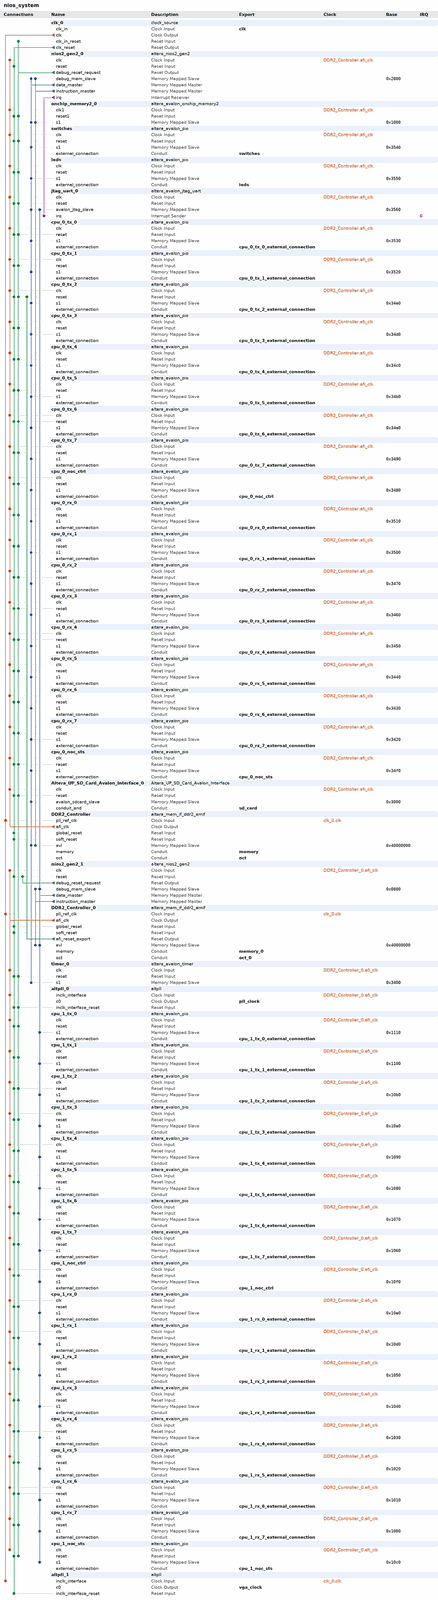
[diagram p0: system contents, whole]
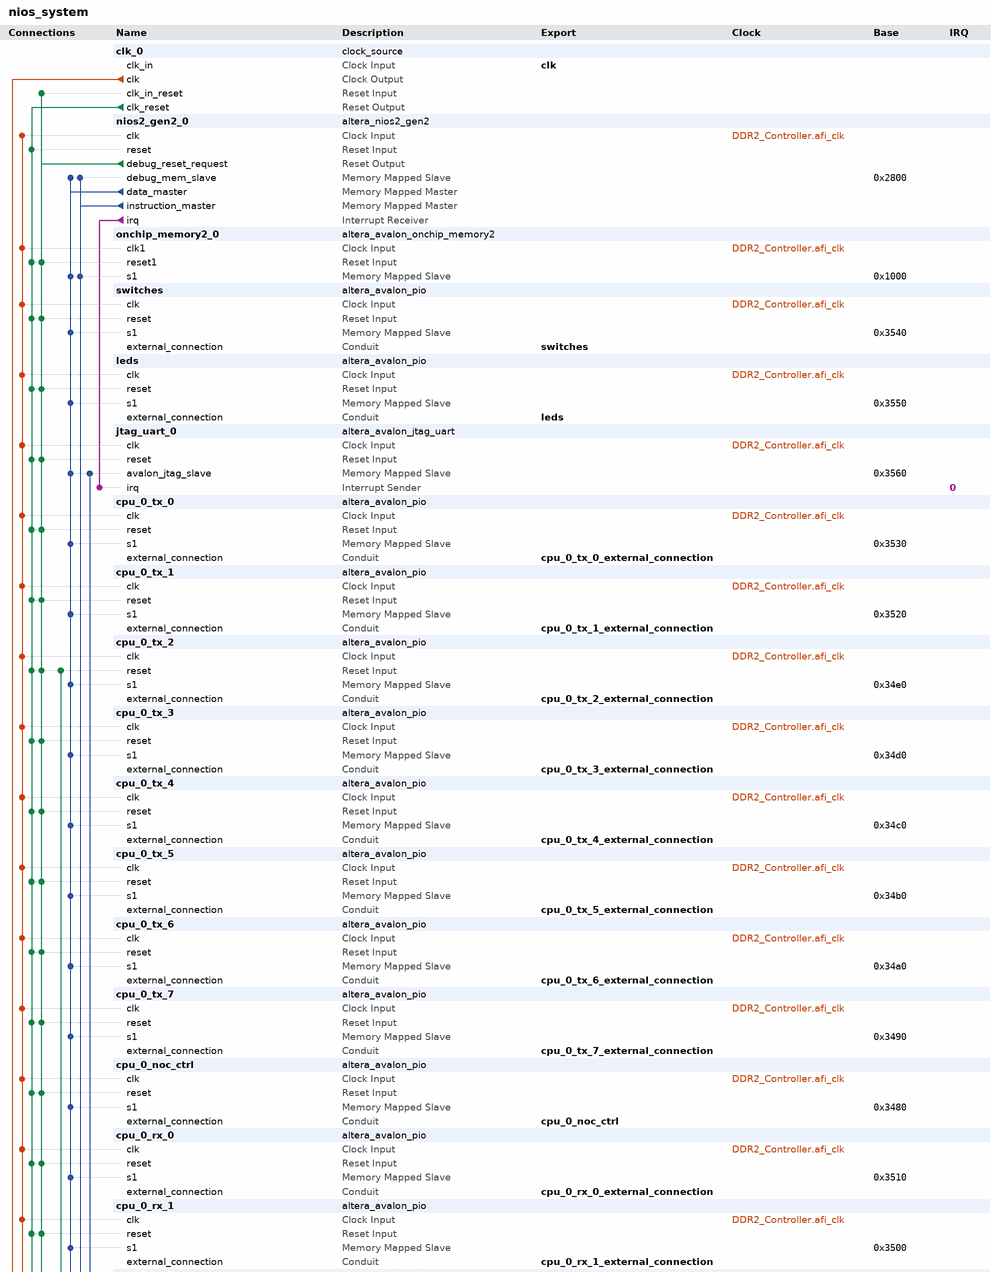
[diagram p1: system contents, upper part]
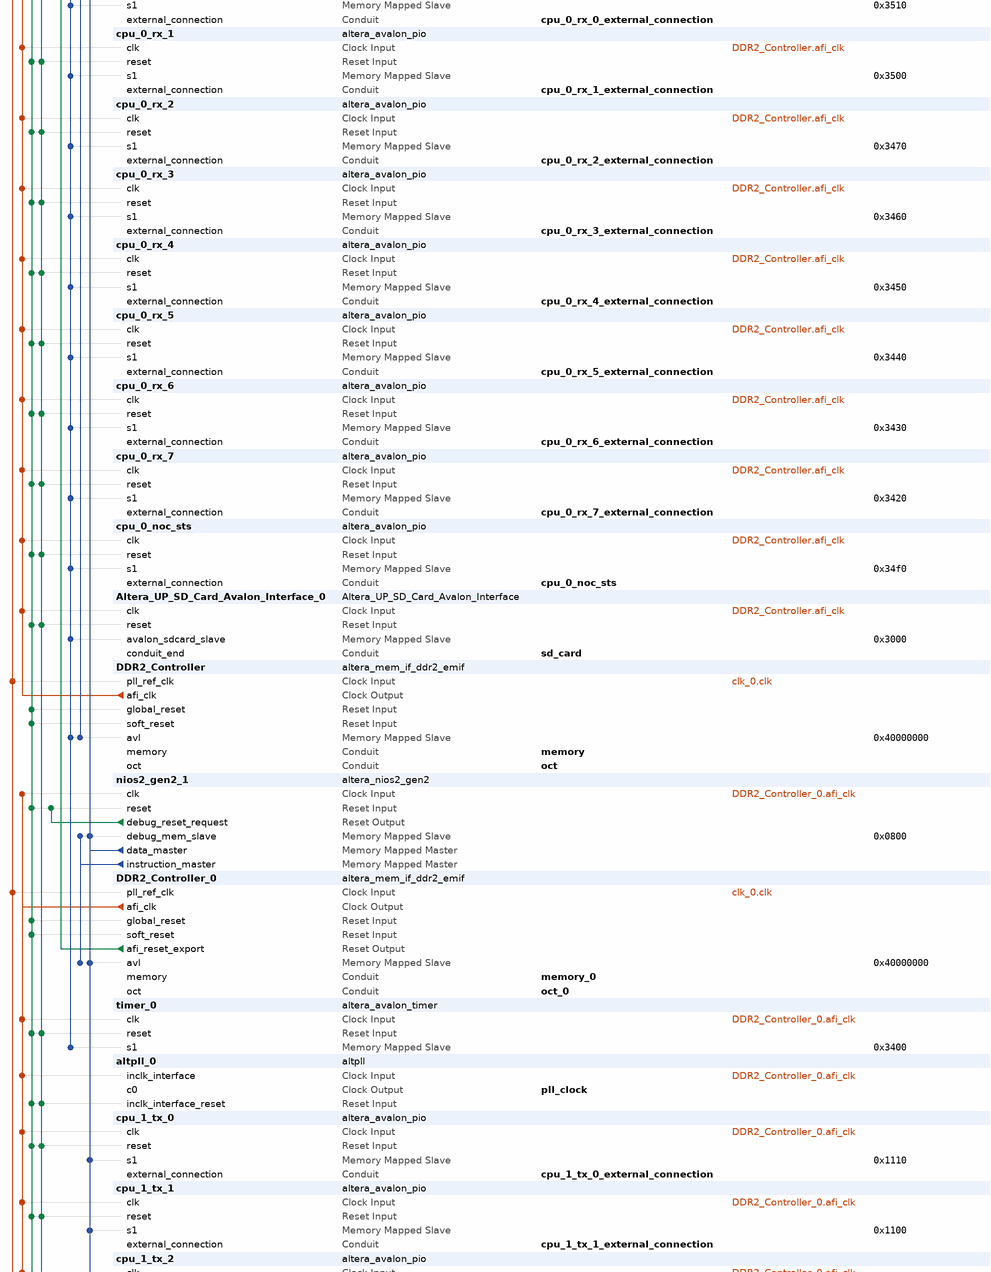
[diagram p2: system contents, middle part]
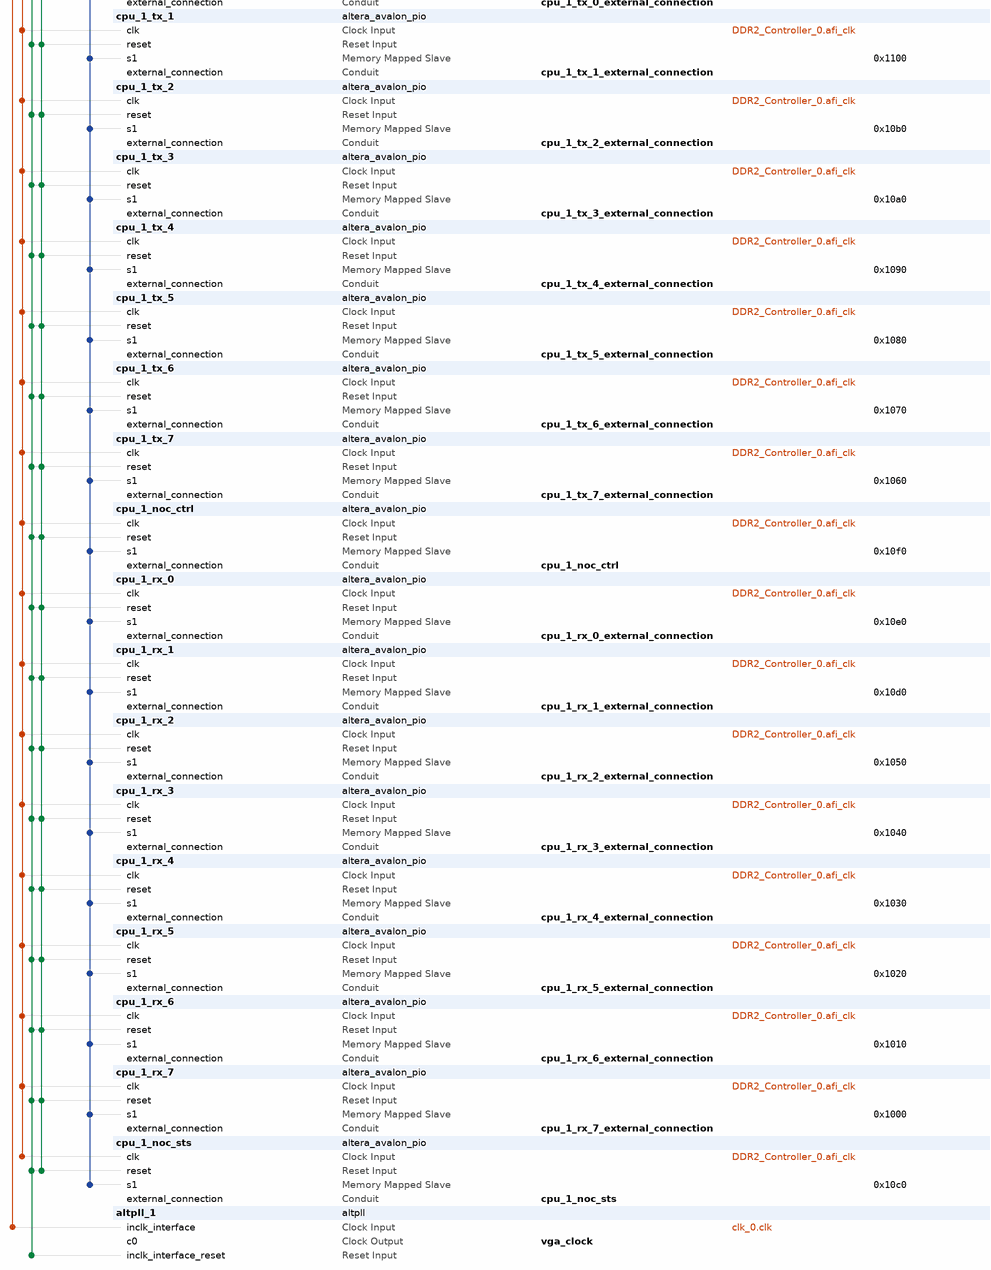
[diagram p3: system contents, lower part]
# Platform Designer (Qsys) system nios_system, Stratix IV EP4SGX230KF40C2
# Parameters at their usual value, and those the tool derives, are not listed.
package require -exact qsys 16.1
create_system nios_system
set_project_property DEVICE_FAMILY {Stratix IV}
set_project_property DEVICE EP4SGX230KF40C2

add_instance clk_0 clock_source 16.1
set_instance_parameter_value clk_0 clockFrequency 50000000

add_instance nios2_gen2_0 altera_nios2_gen2 16.1
set_instance_parameter_value nios2_gen2_0 dcache_size 2048
set_instance_parameter_value nios2_gen2_0 exceptionSlave DDR2_Controller.avl
set_instance_parameter_value nios2_gen2_0 icache_size 4096
set_instance_parameter_value nios2_gen2_0 impl Fast
set_instance_parameter_value nios2_gen2_0 resetSlave DDR2_Controller.avl
set_instance_parameter_value nios2_gen2_0 setting_support31bitdcachebypass false

add_instance onchip_memory2_0 altera_avalon_onchip_memory2 16.1
set_instance_parameter_value onchip_memory2_0 dataWidth 32
set_instance_parameter_value onchip_memory2_0 dualPort false
set_instance_parameter_value onchip_memory2_0 initMemContent true
set_instance_parameter_value onchip_memory2_0 initializationFileName onchip_mem.hex
set_instance_parameter_value onchip_memory2_0 memorySize 4096

add_instance switches altera_avalon_pio 16.1
set_instance_parameter_value switches direction Input
set_instance_parameter_value switches width 8

add_instance leds altera_avalon_pio 16.1
set_instance_parameter_value leds direction Output
set_instance_parameter_value leds width 8

add_instance jtag_uart_0 altera_avalon_jtag_uart 16.1
set_instance_parameter_value jtag_uart_0 simInteractiveOptions NO_INTERACTIVE_WINDOWS

add_instance cpu_0_tx_0 altera_avalon_pio 16.1
set_instance_parameter_value cpu_0_tx_0 direction Output
set_instance_parameter_value cpu_0_tx_0 width 32

add_instance cpu_0_tx_1 altera_avalon_pio 16.1
set_instance_parameter_value cpu_0_tx_1 direction Output
set_instance_parameter_value cpu_0_tx_1 width 32

add_instance cpu_0_tx_2 altera_avalon_pio 16.1
set_instance_parameter_value cpu_0_tx_2 direction Output
set_instance_parameter_value cpu_0_tx_2 width 32

add_instance cpu_0_tx_3 altera_avalon_pio 16.1
set_instance_parameter_value cpu_0_tx_3 direction Output
set_instance_parameter_value cpu_0_tx_3 width 32

add_instance cpu_0_tx_4 altera_avalon_pio 16.1
set_instance_parameter_value cpu_0_tx_4 direction Output
set_instance_parameter_value cpu_0_tx_4 width 32

add_instance cpu_0_tx_5 altera_avalon_pio 16.1
set_instance_parameter_value cpu_0_tx_5 direction Output
set_instance_parameter_value cpu_0_tx_5 width 32

add_instance cpu_0_tx_6 altera_avalon_pio 16.1
set_instance_parameter_value cpu_0_tx_6 direction Output
set_instance_parameter_value cpu_0_tx_6 width 32

add_instance cpu_0_tx_7 altera_avalon_pio 16.1
set_instance_parameter_value cpu_0_tx_7 direction Output
set_instance_parameter_value cpu_0_tx_7 width 32

add_instance cpu_0_noc_ctrl altera_avalon_pio 16.1
set_instance_parameter_value cpu_0_noc_ctrl direction Output
set_instance_parameter_value cpu_0_noc_ctrl width 32

add_instance cpu_0_rx_0 altera_avalon_pio 16.1
set_instance_parameter_value cpu_0_rx_0 direction Input
set_instance_parameter_value cpu_0_rx_0 width 32

add_instance cpu_0_rx_1 altera_avalon_pio 16.1
set_instance_parameter_value cpu_0_rx_1 direction Input
set_instance_parameter_value cpu_0_rx_1 width 32

add_instance cpu_0_rx_2 altera_avalon_pio 16.1
set_instance_parameter_value cpu_0_rx_2 direction Input
set_instance_parameter_value cpu_0_rx_2 width 32

add_instance cpu_0_rx_3 altera_avalon_pio 16.1
set_instance_parameter_value cpu_0_rx_3 direction Input
set_instance_parameter_value cpu_0_rx_3 width 32

add_instance cpu_0_rx_4 altera_avalon_pio 16.1
set_instance_parameter_value cpu_0_rx_4 direction Input
set_instance_parameter_value cpu_0_rx_4 width 32

add_instance cpu_0_rx_5 altera_avalon_pio 16.1
set_instance_parameter_value cpu_0_rx_5 direction Input
set_instance_parameter_value cpu_0_rx_5 width 32

add_instance cpu_0_rx_6 altera_avalon_pio 16.1
set_instance_parameter_value cpu_0_rx_6 direction Input
set_instance_parameter_value cpu_0_rx_6 width 32

add_instance cpu_0_rx_7 altera_avalon_pio 16.1
set_instance_parameter_value cpu_0_rx_7 direction Input
set_instance_parameter_value cpu_0_rx_7 width 32

add_instance cpu_0_noc_sts altera_avalon_pio 16.1
set_instance_parameter_value cpu_0_noc_sts direction Input
set_instance_parameter_value cpu_0_noc_sts width 32

add_instance Altera_UP_SD_Card_Avalon_Interface_0 Altera_UP_SD_Card_Avalon_Interface 16.0

add_instance DDR2_Controller altera_mem_if_ddr2_emif 16.1
set_instance_parameter_value DDR2_Controller AVL_MAX_SIZE 4
set_instance_parameter_value DDR2_Controller CALIBRATION_MODE Skip
set_instance_parameter_value DDR2_Controller DLL_SHARING_MODE None
set_instance_parameter_value DDR2_Controller EXPORT_AFI_HALF_CLK false
set_instance_parameter_value DDR2_Controller MEM_BANKADDR_WIDTH 3
set_instance_parameter_value DDR2_Controller MEM_CLK_FREQ 400.0
set_instance_parameter_value DDR2_Controller MEM_COL_ADDR_WIDTH 10
set_instance_parameter_value DDR2_Controller MEM_DQ_WIDTH 64
set_instance_parameter_value DDR2_Controller MEM_NUMBER_OF_RANKS_PER_DIMM 1
set_instance_parameter_value DDR2_Controller MEM_ROW_ADDR_WIDTH 14
set_instance_parameter_value DDR2_Controller MEM_TCL 6
set_instance_parameter_value DDR2_Controller MEM_TRAS_NS 40.0
set_instance_parameter_value DDR2_Controller MEM_VENDOR Hynix
set_instance_parameter_value DDR2_Controller PLL_SHARING_MODE None
set_instance_parameter_value DDR2_Controller POWER_OF_TWO_BUS false
set_instance_parameter_value DDR2_Controller REF_CLK_FREQ 50.0
set_instance_parameter_value DDR2_Controller TIMING_BOARD_AC_TO_CK_SKEW 0.0
set_instance_parameter_value DDR2_Controller TIMING_TDQSQ 200
set_instance_parameter_value DDR2_Controller TIMING_TIH 375
set_instance_parameter_value DDR2_Controller TIMING_TQHS 300
set_instance_parameter_value DDR2_Controller USER_DEBUG_LEVEL 1

add_instance nios2_gen2_1 altera_nios2_gen2 16.1
set_instance_parameter_value nios2_gen2_1 dcache_size 2048
set_instance_parameter_value nios2_gen2_1 exceptionSlave DDR2_Controller_0.avl
set_instance_parameter_value nios2_gen2_1 icache_size 4096
set_instance_parameter_value nios2_gen2_1 impl Fast
set_instance_parameter_value nios2_gen2_1 resetSlave DDR2_Controller_0.avl
set_instance_parameter_value nios2_gen2_1 setting_support31bitdcachebypass false

add_instance DDR2_Controller_0 altera_mem_if_ddr2_emif 16.1
set_instance_parameter_value DDR2_Controller_0 AVL_MAX_SIZE 4
set_instance_parameter_value DDR2_Controller_0 CALIBRATION_MODE Skip
set_instance_parameter_value DDR2_Controller_0 DLL_SHARING_MODE None
set_instance_parameter_value DDR2_Controller_0 EXPORT_AFI_HALF_CLK false
set_instance_parameter_value DDR2_Controller_0 MEM_BANKADDR_WIDTH 3
set_instance_parameter_value DDR2_Controller_0 MEM_CLK_FREQ 400.0
set_instance_parameter_value DDR2_Controller_0 MEM_COL_ADDR_WIDTH 10
set_instance_parameter_value DDR2_Controller_0 MEM_DQ_WIDTH 64
set_instance_parameter_value DDR2_Controller_0 MEM_NUMBER_OF_RANKS_PER_DIMM 1
set_instance_parameter_value DDR2_Controller_0 MEM_ROW_ADDR_WIDTH 14
set_instance_parameter_value DDR2_Controller_0 MEM_TCL 6
set_instance_parameter_value DDR2_Controller_0 MEM_TRAS_NS 40.0
set_instance_parameter_value DDR2_Controller_0 MEM_VENDOR Hynix
set_instance_parameter_value DDR2_Controller_0 PLL_SHARING_MODE None
set_instance_parameter_value DDR2_Controller_0 POWER_OF_TWO_BUS false
set_instance_parameter_value DDR2_Controller_0 REF_CLK_FREQ 50.0
set_instance_parameter_value DDR2_Controller_0 TIMING_BOARD_AC_TO_CK_SKEW 0.0
set_instance_parameter_value DDR2_Controller_0 TIMING_TDQSQ 200
set_instance_parameter_value DDR2_Controller_0 TIMING_TIH 375
set_instance_parameter_value DDR2_Controller_0 TIMING_TQHS 300
set_instance_parameter_value DDR2_Controller_0 USER_DEBUG_LEVEL 1

add_instance timer_0 altera_avalon_timer 16.1
set_instance_parameter_value timer_0 period 10
set_instance_parameter_value timer_0 periodUnits MSEC

add_instance altpll_0 altpll 16.1
set_instance_parameter_value altpll_0 CLK0_DIVIDE_BY 2
set_instance_parameter_value altpll_0 CLK0_MULTIPLY_BY 1
set_instance_parameter_value altpll_0 INCLK0_INPUT_FREQUENCY 2500
set_instance_parameter_value altpll_0 PORT_ARESET PORT_UNUSED
set_instance_parameter_value altpll_0 PORT_FBOUT PORT_UNUSED
set_instance_parameter_value altpll_0 PORT_LOCKED PORT_UNUSED
set_instance_parameter_value altpll_0 PORT_clk1 PORT_UNUSED
set_instance_parameter_value altpll_0 PORT_clk2 PORT_UNUSED
set_instance_parameter_value altpll_0 PORT_clk3 PORT_UNUSED
set_instance_parameter_value altpll_0 PORT_clk6 PORT_UNUSED
set_instance_parameter_value altpll_0 PORT_clk7 PORT_UNUSED
set_instance_parameter_value altpll_0 PORT_clk8 PORT_UNUSED
set_instance_parameter_value altpll_0 PORT_clk9 PORT_UNUSED
set_instance_parameter_value altpll_0 USING_FBMIMICBIDIR_PORT OFF
set_instance_parameter_value altpll_0 WIDTH_CLOCK 10

add_instance cpu_1_tx_0 altera_avalon_pio 16.1
set_instance_parameter_value cpu_1_tx_0 direction Output
set_instance_parameter_value cpu_1_tx_0 width 32

add_instance cpu_1_tx_1 altera_avalon_pio 16.1
set_instance_parameter_value cpu_1_tx_1 direction Output
set_instance_parameter_value cpu_1_tx_1 width 32

add_instance cpu_1_tx_2 altera_avalon_pio 16.1
set_instance_parameter_value cpu_1_tx_2 direction Output
set_instance_parameter_value cpu_1_tx_2 width 32

add_instance cpu_1_tx_3 altera_avalon_pio 16.1
set_instance_parameter_value cpu_1_tx_3 direction Output
set_instance_parameter_value cpu_1_tx_3 width 32

add_instance cpu_1_tx_4 altera_avalon_pio 16.1
set_instance_parameter_value cpu_1_tx_4 direction Output
set_instance_parameter_value cpu_1_tx_4 width 32

add_instance cpu_1_tx_5 altera_avalon_pio 16.1
set_instance_parameter_value cpu_1_tx_5 direction Output
set_instance_parameter_value cpu_1_tx_5 width 32

add_instance cpu_1_tx_6 altera_avalon_pio 16.1
set_instance_parameter_value cpu_1_tx_6 direction Output
set_instance_parameter_value cpu_1_tx_6 width 32

add_instance cpu_1_tx_7 altera_avalon_pio 16.1
set_instance_parameter_value cpu_1_tx_7 direction Output
set_instance_parameter_value cpu_1_tx_7 width 32

add_instance cpu_1_noc_ctrl altera_avalon_pio 16.1
set_instance_parameter_value cpu_1_noc_ctrl direction Output
set_instance_parameter_value cpu_1_noc_ctrl width 32

add_instance cpu_1_rx_0 altera_avalon_pio 16.1
set_instance_parameter_value cpu_1_rx_0 direction Input
set_instance_parameter_value cpu_1_rx_0 width 32

add_instance cpu_1_rx_1 altera_avalon_pio 16.1
set_instance_parameter_value cpu_1_rx_1 direction Input
set_instance_parameter_value cpu_1_rx_1 width 32

add_instance cpu_1_rx_2 altera_avalon_pio 16.1
set_instance_parameter_value cpu_1_rx_2 direction Input
set_instance_parameter_value cpu_1_rx_2 width 32

add_instance cpu_1_rx_3 altera_avalon_pio 16.1
set_instance_parameter_value cpu_1_rx_3 direction Input
set_instance_parameter_value cpu_1_rx_3 width 32

add_instance cpu_1_rx_4 altera_avalon_pio 16.1
set_instance_parameter_value cpu_1_rx_4 direction Input
set_instance_parameter_value cpu_1_rx_4 width 32

add_instance cpu_1_rx_5 altera_avalon_pio 16.1
set_instance_parameter_value cpu_1_rx_5 direction Input
set_instance_parameter_value cpu_1_rx_5 width 32

add_instance cpu_1_rx_6 altera_avalon_pio 16.1
set_instance_parameter_value cpu_1_rx_6 direction Input
set_instance_parameter_value cpu_1_rx_6 width 32

add_instance cpu_1_rx_7 altera_avalon_pio 16.1
set_instance_parameter_value cpu_1_rx_7 direction Input
set_instance_parameter_value cpu_1_rx_7 width 32

add_instance cpu_1_noc_sts altera_avalon_pio 16.1
set_instance_parameter_value cpu_1_noc_sts direction Input
set_instance_parameter_value cpu_1_noc_sts width 32

add_instance altpll_1 altpll 16.1
set_instance_parameter_value altpll_1 CLK0_DIVIDE_BY 50
set_instance_parameter_value altpll_1 CLK0_MULTIPLY_BY 27
set_instance_parameter_value altpll_1 INCLK0_INPUT_FREQUENCY 20000
set_instance_parameter_value altpll_1 PORT_ARESET PORT_UNUSED
set_instance_parameter_value altpll_1 PORT_FBOUT PORT_UNUSED
set_instance_parameter_value altpll_1 PORT_LOCKED PORT_UNUSED
set_instance_parameter_value altpll_1 PORT_clk1 PORT_UNUSED
set_instance_parameter_value altpll_1 PORT_clk2 PORT_UNUSED
set_instance_parameter_value altpll_1 PORT_clk3 PORT_UNUSED
set_instance_parameter_value altpll_1 PORT_clk6 PORT_UNUSED
set_instance_parameter_value altpll_1 PORT_clk7 PORT_UNUSED
set_instance_parameter_value altpll_1 PORT_clk8 PORT_UNUSED
set_instance_parameter_value altpll_1 PORT_clk9 PORT_UNUSED
set_instance_parameter_value altpll_1 USING_FBMIMICBIDIR_PORT OFF
set_instance_parameter_value altpll_1 WIDTH_CLOCK 10

# connections
add_connection clk_0.clk altpll_1.inclk_interface clock
add_connection clk_0.clk DDR2_Controller.pll_ref_clk clock
add_connection clk_0.clk DDR2_Controller_0.pll_ref_clk clock
add_connection DDR2_Controller.afi_clk Altera_UP_SD_Card_Avalon_Interface_0.clk clock
add_connection DDR2_Controller.afi_clk cpu_0_noc_ctrl.clk clock
add_connection DDR2_Controller.afi_clk cpu_0_noc_sts.clk clock
add_connection DDR2_Controller.afi_clk cpu_0_rx_0.clk clock
add_connection DDR2_Controller.afi_clk cpu_0_rx_1.clk clock
add_connection DDR2_Controller.afi_clk cpu_0_rx_2.clk clock
add_connection DDR2_Controller.afi_clk cpu_0_rx_3.clk clock
add_connection DDR2_Controller.afi_clk cpu_0_rx_4.clk clock
add_connection DDR2_Controller.afi_clk cpu_0_rx_5.clk clock
add_connection DDR2_Controller.afi_clk cpu_0_rx_6.clk clock
add_connection DDR2_Controller.afi_clk cpu_0_rx_7.clk clock
add_connection DDR2_Controller.afi_clk cpu_0_tx_0.clk clock
add_connection DDR2_Controller.afi_clk cpu_0_tx_1.clk clock
add_connection DDR2_Controller.afi_clk cpu_0_tx_2.clk clock
add_connection DDR2_Controller.afi_clk cpu_0_tx_3.clk clock
add_connection DDR2_Controller.afi_clk cpu_0_tx_4.clk clock
add_connection DDR2_Controller.afi_clk cpu_0_tx_5.clk clock
add_connection DDR2_Controller.afi_clk cpu_0_tx_6.clk clock
add_connection DDR2_Controller.afi_clk cpu_0_tx_7.clk clock
add_connection DDR2_Controller.afi_clk jtag_uart_0.clk clock
add_connection DDR2_Controller.afi_clk leds.clk clock
add_connection DDR2_Controller.afi_clk nios2_gen2_0.clk clock
add_connection DDR2_Controller.afi_clk onchip_memory2_0.clk1 clock
add_connection DDR2_Controller.afi_clk switches.clk clock
add_connection DDR2_Controller_0.afi_clk altpll_0.inclk_interface clock
add_connection DDR2_Controller_0.afi_clk cpu_1_noc_ctrl.clk clock
add_connection DDR2_Controller_0.afi_clk cpu_1_noc_sts.clk clock
add_connection DDR2_Controller_0.afi_clk cpu_1_rx_0.clk clock
add_connection DDR2_Controller_0.afi_clk cpu_1_rx_1.clk clock
add_connection DDR2_Controller_0.afi_clk cpu_1_rx_2.clk clock
add_connection DDR2_Controller_0.afi_clk cpu_1_rx_3.clk clock
add_connection DDR2_Controller_0.afi_clk cpu_1_rx_4.clk clock
add_connection DDR2_Controller_0.afi_clk cpu_1_rx_5.clk clock
add_connection DDR2_Controller_0.afi_clk cpu_1_rx_6.clk clock
add_connection DDR2_Controller_0.afi_clk cpu_1_rx_7.clk clock
add_connection DDR2_Controller_0.afi_clk cpu_1_tx_0.clk clock
add_connection DDR2_Controller_0.afi_clk cpu_1_tx_1.clk clock
add_connection DDR2_Controller_0.afi_clk cpu_1_tx_2.clk clock
add_connection DDR2_Controller_0.afi_clk cpu_1_tx_3.clk clock
add_connection DDR2_Controller_0.afi_clk cpu_1_tx_4.clk clock
add_connection DDR2_Controller_0.afi_clk cpu_1_tx_5.clk clock
add_connection DDR2_Controller_0.afi_clk cpu_1_tx_6.clk clock
add_connection DDR2_Controller_0.afi_clk cpu_1_tx_7.clk clock
add_connection DDR2_Controller_0.afi_clk nios2_gen2_1.clk clock
add_connection DDR2_Controller_0.afi_clk timer_0.clk clock
add_connection clk_0.clk_reset Altera_UP_SD_Card_Avalon_Interface_0.reset reset
add_connection clk_0.clk_reset altpll_0.inclk_interface_reset reset
add_connection clk_0.clk_reset altpll_1.inclk_interface_reset reset
add_connection clk_0.clk_reset cpu_0_noc_ctrl.reset reset
add_connection clk_0.clk_reset cpu_0_noc_sts.reset reset
add_connection clk_0.clk_reset cpu_0_rx_0.reset reset
add_connection clk_0.clk_reset cpu_0_rx_1.reset reset
add_connection clk_0.clk_reset cpu_0_rx_2.reset reset
add_connection clk_0.clk_reset cpu_0_rx_3.reset reset
add_connection clk_0.clk_reset cpu_0_rx_4.reset reset
add_connection clk_0.clk_reset cpu_0_rx_5.reset reset
add_connection clk_0.clk_reset cpu_0_rx_6.reset reset
add_connection clk_0.clk_reset cpu_0_rx_7.reset reset
add_connection clk_0.clk_reset cpu_0_tx_0.reset reset
add_connection clk_0.clk_reset cpu_0_tx_1.reset reset
add_connection clk_0.clk_reset cpu_0_tx_2.reset reset
add_connection clk_0.clk_reset cpu_0_tx_3.reset reset
add_connection clk_0.clk_reset cpu_0_tx_4.reset reset
add_connection clk_0.clk_reset cpu_0_tx_5.reset reset
add_connection clk_0.clk_reset cpu_0_tx_6.reset reset
add_connection clk_0.clk_reset cpu_0_tx_7.reset reset
add_connection clk_0.clk_reset cpu_1_noc_ctrl.reset reset
add_connection clk_0.clk_reset cpu_1_noc_sts.reset reset
add_connection clk_0.clk_reset cpu_1_rx_0.reset reset
add_connection clk_0.clk_reset cpu_1_rx_1.reset reset
add_connection clk_0.clk_reset cpu_1_rx_2.reset reset
add_connection clk_0.clk_reset cpu_1_rx_3.reset reset
add_connection clk_0.clk_reset cpu_1_rx_4.reset reset
add_connection clk_0.clk_reset cpu_1_rx_5.reset reset
add_connection clk_0.clk_reset cpu_1_rx_6.reset reset
add_connection clk_0.clk_reset cpu_1_rx_7.reset reset
add_connection clk_0.clk_reset cpu_1_tx_0.reset reset
add_connection clk_0.clk_reset cpu_1_tx_1.reset reset
add_connection clk_0.clk_reset cpu_1_tx_2.reset reset
add_connection clk_0.clk_reset cpu_1_tx_3.reset reset
add_connection clk_0.clk_reset cpu_1_tx_4.reset reset
add_connection clk_0.clk_reset cpu_1_tx_5.reset reset
add_connection clk_0.clk_reset cpu_1_tx_6.reset reset
add_connection clk_0.clk_reset cpu_1_tx_7.reset reset
add_connection clk_0.clk_reset DDR2_Controller.global_reset reset
add_connection clk_0.clk_reset DDR2_Controller.soft_reset reset
add_connection clk_0.clk_reset DDR2_Controller_0.global_reset reset
add_connection clk_0.clk_reset DDR2_Controller_0.soft_reset reset
add_connection clk_0.clk_reset jtag_uart_0.reset reset
add_connection clk_0.clk_reset leds.reset reset
add_connection clk_0.clk_reset nios2_gen2_0.reset reset
add_connection clk_0.clk_reset nios2_gen2_1.reset reset
add_connection clk_0.clk_reset onchip_memory2_0.reset1 reset
add_connection clk_0.clk_reset switches.reset reset
add_connection clk_0.clk_reset timer_0.reset reset
add_connection DDR2_Controller_0.afi_reset_export cpu_0_tx_2.reset reset
add_connection nios2_gen2_0.debug_reset_request Altera_UP_SD_Card_Avalon_Interface_0.reset reset
add_connection nios2_gen2_0.debug_reset_request altpll_0.inclk_interface_reset reset
add_connection nios2_gen2_0.debug_reset_request clk_0.clk_in_reset reset
add_connection nios2_gen2_0.debug_reset_request cpu_0_noc_ctrl.reset reset
add_connection nios2_gen2_0.debug_reset_request cpu_0_noc_sts.reset reset
add_connection nios2_gen2_0.debug_reset_request cpu_0_rx_0.reset reset
add_connection nios2_gen2_0.debug_reset_request cpu_0_rx_1.reset reset
add_connection nios2_gen2_0.debug_reset_request cpu_0_rx_2.reset reset
add_connection nios2_gen2_0.debug_reset_request cpu_0_rx_3.reset reset
add_connection nios2_gen2_0.debug_reset_request cpu_0_rx_4.reset reset
add_connection nios2_gen2_0.debug_reset_request cpu_0_rx_5.reset reset
add_connection nios2_gen2_0.debug_reset_request cpu_0_rx_6.reset reset
add_connection nios2_gen2_0.debug_reset_request cpu_0_rx_7.reset reset
add_connection nios2_gen2_0.debug_reset_request cpu_0_tx_0.reset reset
add_connection nios2_gen2_0.debug_reset_request cpu_0_tx_1.reset reset
add_connection nios2_gen2_0.debug_reset_request cpu_0_tx_2.reset reset
add_connection nios2_gen2_0.debug_reset_request cpu_0_tx_3.reset reset
add_connection nios2_gen2_0.debug_reset_request cpu_0_tx_4.reset reset
add_connection nios2_gen2_0.debug_reset_request cpu_0_tx_5.reset reset
add_connection nios2_gen2_0.debug_reset_request cpu_0_tx_6.reset reset
add_connection nios2_gen2_0.debug_reset_request cpu_0_tx_7.reset reset
add_connection nios2_gen2_0.debug_reset_request cpu_1_noc_ctrl.reset reset
add_connection nios2_gen2_0.debug_reset_request cpu_1_noc_sts.reset reset
add_connection nios2_gen2_0.debug_reset_request cpu_1_rx_0.reset reset
add_connection nios2_gen2_0.debug_reset_request cpu_1_rx_1.reset reset
add_connection nios2_gen2_0.debug_reset_request cpu_1_rx_2.reset reset
add_connection nios2_gen2_0.debug_reset_request cpu_1_rx_3.reset reset
add_connection nios2_gen2_0.debug_reset_request cpu_1_rx_4.reset reset
add_connection nios2_gen2_0.debug_reset_request cpu_1_rx_5.reset reset
add_connection nios2_gen2_0.debug_reset_request cpu_1_rx_6.reset reset
add_connection nios2_gen2_0.debug_reset_request cpu_1_rx_7.reset reset
add_connection nios2_gen2_0.debug_reset_request cpu_1_tx_0.reset reset
add_connection nios2_gen2_0.debug_reset_request cpu_1_tx_1.reset reset
add_connection nios2_gen2_0.debug_reset_request cpu_1_tx_2.reset reset
add_connection nios2_gen2_0.debug_reset_request cpu_1_tx_3.reset reset
add_connection nios2_gen2_0.debug_reset_request cpu_1_tx_4.reset reset
add_connection nios2_gen2_0.debug_reset_request cpu_1_tx_5.reset reset
add_connection nios2_gen2_0.debug_reset_request cpu_1_tx_6.reset reset
add_connection nios2_gen2_0.debug_reset_request cpu_1_tx_7.reset reset
add_connection nios2_gen2_0.debug_reset_request jtag_uart_0.reset reset
add_connection nios2_gen2_0.debug_reset_request leds.reset reset
add_connection nios2_gen2_0.debug_reset_request onchip_memory2_0.reset1 reset
add_connection nios2_gen2_0.debug_reset_request switches.reset reset
add_connection nios2_gen2_0.debug_reset_request timer_0.reset reset
add_connection nios2_gen2_1.debug_reset_request nios2_gen2_1.reset reset
add_connection nios2_gen2_0.data_master Altera_UP_SD_Card_Avalon_Interface_0.avalon_sdcard_slave avalon
set_connection_parameter_value nios2_gen2_0.data_master/Altera_UP_SD_Card_Avalon_Interface_0.avalon_sdcard_slave baseAddress 0x3000
add_connection nios2_gen2_0.data_master cpu_0_noc_ctrl.s1 avalon
set_connection_parameter_value nios2_gen2_0.data_master/cpu_0_noc_ctrl.s1 baseAddress 0x3480
add_connection nios2_gen2_0.data_master cpu_0_noc_sts.s1 avalon
set_connection_parameter_value nios2_gen2_0.data_master/cpu_0_noc_sts.s1 baseAddress 0x34f0
add_connection nios2_gen2_0.data_master cpu_0_rx_0.s1 avalon
set_connection_parameter_value nios2_gen2_0.data_master/cpu_0_rx_0.s1 baseAddress 0x3510
add_connection nios2_gen2_0.data_master cpu_0_rx_1.s1 avalon
set_connection_parameter_value nios2_gen2_0.data_master/cpu_0_rx_1.s1 baseAddress 0x3500
add_connection nios2_gen2_0.data_master cpu_0_rx_2.s1 avalon
set_connection_parameter_value nios2_gen2_0.data_master/cpu_0_rx_2.s1 baseAddress 0x3470
add_connection nios2_gen2_0.data_master cpu_0_rx_3.s1 avalon
set_connection_parameter_value nios2_gen2_0.data_master/cpu_0_rx_3.s1 baseAddress 0x3460
add_connection nios2_gen2_0.data_master cpu_0_rx_4.s1 avalon
set_connection_parameter_value nios2_gen2_0.data_master/cpu_0_rx_4.s1 baseAddress 0x3450
add_connection nios2_gen2_0.data_master cpu_0_rx_5.s1 avalon
set_connection_parameter_value nios2_gen2_0.data_master/cpu_0_rx_5.s1 baseAddress 0x3440
add_connection nios2_gen2_0.data_master cpu_0_rx_6.s1 avalon
set_connection_parameter_value nios2_gen2_0.data_master/cpu_0_rx_6.s1 baseAddress 0x3430
add_connection nios2_gen2_0.data_master cpu_0_rx_7.s1 avalon
set_connection_parameter_value nios2_gen2_0.data_master/cpu_0_rx_7.s1 baseAddress 0x3420
add_connection nios2_gen2_0.data_master cpu_0_tx_0.s1 avalon
set_connection_parameter_value nios2_gen2_0.data_master/cpu_0_tx_0.s1 baseAddress 0x3530
add_connection nios2_gen2_0.data_master cpu_0_tx_1.s1 avalon
set_connection_parameter_value nios2_gen2_0.data_master/cpu_0_tx_1.s1 baseAddress 0x3520
add_connection nios2_gen2_0.data_master cpu_0_tx_2.s1 avalon
set_connection_parameter_value nios2_gen2_0.data_master/cpu_0_tx_2.s1 baseAddress 0x34e0
add_connection nios2_gen2_0.data_master cpu_0_tx_3.s1 avalon
set_connection_parameter_value nios2_gen2_0.data_master/cpu_0_tx_3.s1 baseAddress 0x34d0
add_connection nios2_gen2_0.data_master cpu_0_tx_4.s1 avalon
set_connection_parameter_value nios2_gen2_0.data_master/cpu_0_tx_4.s1 baseAddress 0x34c0
add_connection nios2_gen2_0.data_master cpu_0_tx_5.s1 avalon
set_connection_parameter_value nios2_gen2_0.data_master/cpu_0_tx_5.s1 baseAddress 0x34b0
add_connection nios2_gen2_0.data_master cpu_0_tx_6.s1 avalon
set_connection_parameter_value nios2_gen2_0.data_master/cpu_0_tx_6.s1 baseAddress 0x34a0
add_connection nios2_gen2_0.data_master cpu_0_tx_7.s1 avalon
set_connection_parameter_value nios2_gen2_0.data_master/cpu_0_tx_7.s1 baseAddress 0x3490
add_connection nios2_gen2_0.data_master DDR2_Controller.avl avalon
set_connection_parameter_value nios2_gen2_0.data_master/DDR2_Controller.avl baseAddress 0x40000000
add_connection nios2_gen2_0.data_master jtag_uart_0.avalon_jtag_slave avalon
set_connection_parameter_value nios2_gen2_0.data_master/jtag_uart_0.avalon_jtag_slave baseAddress 0x3560
add_connection nios2_gen2_0.data_master leds.s1 avalon
set_connection_parameter_value nios2_gen2_0.data_master/leds.s1 baseAddress 0x3550
add_connection nios2_gen2_0.data_master nios2_gen2_0.debug_mem_slave avalon
set_connection_parameter_value nios2_gen2_0.data_master/nios2_gen2_0.debug_mem_slave baseAddress 0x2800
add_connection nios2_gen2_0.data_master onchip_memory2_0.s1 avalon
set_connection_parameter_value nios2_gen2_0.data_master/onchip_memory2_0.s1 baseAddress 0x1000
add_connection nios2_gen2_0.data_master switches.s1 avalon
set_connection_parameter_value nios2_gen2_0.data_master/switches.s1 baseAddress 0x3540
add_connection nios2_gen2_0.data_master timer_0.s1 avalon
set_connection_parameter_value nios2_gen2_0.data_master/timer_0.s1 baseAddress 0x3400
add_connection nios2_gen2_0.instruction_master DDR2_Controller.avl avalon
set_connection_parameter_value nios2_gen2_0.instruction_master/DDR2_Controller.avl baseAddress 0x40000000
add_connection nios2_gen2_0.instruction_master nios2_gen2_0.debug_mem_slave avalon
set_connection_parameter_value nios2_gen2_0.instruction_master/nios2_gen2_0.debug_mem_slave baseAddress 0x2800
add_connection nios2_gen2_0.instruction_master onchip_memory2_0.s1 avalon
set_connection_parameter_value nios2_gen2_0.instruction_master/onchip_memory2_0.s1 baseAddress 0x1000
add_connection nios2_gen2_1.data_master cpu_1_noc_ctrl.s1 avalon
set_connection_parameter_value nios2_gen2_1.data_master/cpu_1_noc_ctrl.s1 baseAddress 0x10f0
add_connection nios2_gen2_1.data_master cpu_1_noc_sts.s1 avalon
set_connection_parameter_value nios2_gen2_1.data_master/cpu_1_noc_sts.s1 baseAddress 0x10c0
add_connection nios2_gen2_1.data_master cpu_1_rx_0.s1 avalon
set_connection_parameter_value nios2_gen2_1.data_master/cpu_1_rx_0.s1 baseAddress 0x10e0
add_connection nios2_gen2_1.data_master cpu_1_rx_1.s1 avalon
set_connection_parameter_value nios2_gen2_1.data_master/cpu_1_rx_1.s1 baseAddress 0x10d0
add_connection nios2_gen2_1.data_master cpu_1_rx_2.s1 avalon
set_connection_parameter_value nios2_gen2_1.data_master/cpu_1_rx_2.s1 baseAddress 0x1050
add_connection nios2_gen2_1.data_master cpu_1_rx_3.s1 avalon
set_connection_parameter_value nios2_gen2_1.data_master/cpu_1_rx_3.s1 baseAddress 0x1040
add_connection nios2_gen2_1.data_master cpu_1_rx_4.s1 avalon
set_connection_parameter_value nios2_gen2_1.data_master/cpu_1_rx_4.s1 baseAddress 0x1030
add_connection nios2_gen2_1.data_master cpu_1_rx_5.s1 avalon
set_connection_parameter_value nios2_gen2_1.data_master/cpu_1_rx_5.s1 baseAddress 0x1020
add_connection nios2_gen2_1.data_master cpu_1_rx_6.s1 avalon
set_connection_parameter_value nios2_gen2_1.data_master/cpu_1_rx_6.s1 baseAddress 0x1010
add_connection nios2_gen2_1.data_master cpu_1_rx_7.s1 avalon
set_connection_parameter_value nios2_gen2_1.data_master/cpu_1_rx_7.s1 baseAddress 0x1000
add_connection nios2_gen2_1.data_master cpu_1_tx_0.s1 avalon
set_connection_parameter_value nios2_gen2_1.data_master/cpu_1_tx_0.s1 baseAddress 0x1110
add_connection nios2_gen2_1.data_master cpu_1_tx_1.s1 avalon
set_connection_parameter_value nios2_gen2_1.data_master/cpu_1_tx_1.s1 baseAddress 0x1100
add_connection nios2_gen2_1.data_master cpu_1_tx_2.s1 avalon
set_connection_parameter_value nios2_gen2_1.data_master/cpu_1_tx_2.s1 baseAddress 0x10b0
add_connection nios2_gen2_1.data_master cpu_1_tx_3.s1 avalon
set_connection_parameter_value nios2_gen2_1.data_master/cpu_1_tx_3.s1 baseAddress 0x10a0
add_connection nios2_gen2_1.data_master cpu_1_tx_4.s1 avalon
set_connection_parameter_value nios2_gen2_1.data_master/cpu_1_tx_4.s1 baseAddress 0x1090
add_connection nios2_gen2_1.data_master cpu_1_tx_5.s1 avalon
set_connection_parameter_value nios2_gen2_1.data_master/cpu_1_tx_5.s1 baseAddress 0x1080
add_connection nios2_gen2_1.data_master cpu_1_tx_6.s1 avalon
set_connection_parameter_value nios2_gen2_1.data_master/cpu_1_tx_6.s1 baseAddress 0x1070
add_connection nios2_gen2_1.data_master cpu_1_tx_7.s1 avalon
set_connection_parameter_value nios2_gen2_1.data_master/cpu_1_tx_7.s1 baseAddress 0x1060
add_connection nios2_gen2_1.data_master DDR2_Controller_0.avl avalon
set_connection_parameter_value nios2_gen2_1.data_master/DDR2_Controller_0.avl baseAddress 0x40000000
add_connection nios2_gen2_1.data_master jtag_uart_0.avalon_jtag_slave avalon
set_connection_parameter_value nios2_gen2_1.data_master/jtag_uart_0.avalon_jtag_slave baseAddress 0x3560
add_connection nios2_gen2_1.data_master nios2_gen2_1.debug_mem_slave avalon
set_connection_parameter_value nios2_gen2_1.data_master/nios2_gen2_1.debug_mem_slave baseAddress 0x0800
add_connection nios2_gen2_1.instruction_master DDR2_Controller_0.avl avalon
set_connection_parameter_value nios2_gen2_1.instruction_master/DDR2_Controller_0.avl baseAddress 0x40000000
add_connection nios2_gen2_1.instruction_master nios2_gen2_1.debug_mem_slave avalon
set_connection_parameter_value nios2_gen2_1.instruction_master/nios2_gen2_1.debug_mem_slave baseAddress 0x0800
add_connection nios2_gen2_0.irq jtag_uart_0.irq interrupt
set_connection_parameter_value nios2_gen2_0.irq/jtag_uart_0.irq irqNumber 0

# exported interfaces
add_interface clk clock sink
set_interface_property clk EXPORT_OF clk_0.clk_in
add_interface cpu_0_noc_ctrl conduit end
set_interface_property cpu_0_noc_ctrl EXPORT_OF cpu_0_noc_ctrl.external_connection
add_interface cpu_0_noc_sts conduit end
set_interface_property cpu_0_noc_sts EXPORT_OF cpu_0_noc_sts.external_connection
add_interface cpu_0_rx_0_external_connection conduit end
set_interface_property cpu_0_rx_0_external_connection EXPORT_OF cpu_0_rx_0.external_connection
add_interface cpu_0_rx_1_external_connection conduit end
set_interface_property cpu_0_rx_1_external_connection EXPORT_OF cpu_0_rx_1.external_connection
add_interface cpu_0_rx_2_external_connection conduit end
set_interface_property cpu_0_rx_2_external_connection EXPORT_OF cpu_0_rx_2.external_connection
add_interface cpu_0_rx_3_external_connection conduit end
set_interface_property cpu_0_rx_3_external_connection EXPORT_OF cpu_0_rx_3.external_connection
add_interface cpu_0_rx_4_external_connection conduit end
set_interface_property cpu_0_rx_4_external_connection EXPORT_OF cpu_0_rx_4.external_connection
add_interface cpu_0_rx_5_external_connection conduit end
set_interface_property cpu_0_rx_5_external_connection EXPORT_OF cpu_0_rx_5.external_connection
add_interface cpu_0_rx_6_external_connection conduit end
set_interface_property cpu_0_rx_6_external_connection EXPORT_OF cpu_0_rx_6.external_connection
add_interface cpu_0_rx_7_external_connection conduit end
set_interface_property cpu_0_rx_7_external_connection EXPORT_OF cpu_0_rx_7.external_connection
add_interface cpu_0_tx_0_external_connection conduit end
set_interface_property cpu_0_tx_0_external_connection EXPORT_OF cpu_0_tx_0.external_connection
add_interface cpu_0_tx_1_external_connection conduit end
set_interface_property cpu_0_tx_1_external_connection EXPORT_OF cpu_0_tx_1.external_connection
add_interface cpu_0_tx_2_external_connection conduit end
set_interface_property cpu_0_tx_2_external_connection EXPORT_OF cpu_0_tx_2.external_connection
add_interface cpu_0_tx_3_external_connection conduit end
set_interface_property cpu_0_tx_3_external_connection EXPORT_OF cpu_0_tx_3.external_connection
add_interface cpu_0_tx_4_external_connection conduit end
set_interface_property cpu_0_tx_4_external_connection EXPORT_OF cpu_0_tx_4.external_connection
add_interface cpu_0_tx_5_external_connection conduit end
set_interface_property cpu_0_tx_5_external_connection EXPORT_OF cpu_0_tx_5.external_connection
add_interface cpu_0_tx_6_external_connection conduit end
set_interface_property cpu_0_tx_6_external_connection EXPORT_OF cpu_0_tx_6.external_connection
add_interface cpu_0_tx_7_external_connection conduit end
set_interface_property cpu_0_tx_7_external_connection EXPORT_OF cpu_0_tx_7.external_connection
add_interface cpu_1_noc_ctrl conduit end
set_interface_property cpu_1_noc_ctrl EXPORT_OF cpu_1_noc_ctrl.external_connection
add_interface cpu_1_noc_sts conduit end
set_interface_property cpu_1_noc_sts EXPORT_OF cpu_1_noc_sts.external_connection
add_interface cpu_1_rx_0_external_connection conduit end
set_interface_property cpu_1_rx_0_external_connection EXPORT_OF cpu_1_rx_0.external_connection
add_interface cpu_1_rx_1_external_connection conduit end
set_interface_property cpu_1_rx_1_external_connection EXPORT_OF cpu_1_rx_1.external_connection
add_interface cpu_1_rx_2_external_connection conduit end
set_interface_property cpu_1_rx_2_external_connection EXPORT_OF cpu_1_rx_2.external_connection
add_interface cpu_1_rx_3_external_connection conduit end
set_interface_property cpu_1_rx_3_external_connection EXPORT_OF cpu_1_rx_3.external_connection
add_interface cpu_1_rx_4_external_connection conduit end
set_interface_property cpu_1_rx_4_external_connection EXPORT_OF cpu_1_rx_4.external_connection
add_interface cpu_1_rx_5_external_connection conduit end
set_interface_property cpu_1_rx_5_external_connection EXPORT_OF cpu_1_rx_5.external_connection
add_interface cpu_1_rx_6_external_connection conduit end
set_interface_property cpu_1_rx_6_external_connection EXPORT_OF cpu_1_rx_6.external_connection
add_interface cpu_1_rx_7_external_connection conduit end
set_interface_property cpu_1_rx_7_external_connection EXPORT_OF cpu_1_rx_7.external_connection
add_interface cpu_1_tx_0_external_connection conduit end
set_interface_property cpu_1_tx_0_external_connection EXPORT_OF cpu_1_tx_0.external_connection
add_interface cpu_1_tx_1_external_connection conduit end
set_interface_property cpu_1_tx_1_external_connection EXPORT_OF cpu_1_tx_1.external_connection
add_interface cpu_1_tx_2_external_connection conduit end
set_interface_property cpu_1_tx_2_external_connection EXPORT_OF cpu_1_tx_2.external_connection
add_interface cpu_1_tx_3_external_connection conduit end
set_interface_property cpu_1_tx_3_external_connection EXPORT_OF cpu_1_tx_3.external_connection
add_interface cpu_1_tx_4_external_connection conduit end
set_interface_property cpu_1_tx_4_external_connection EXPORT_OF cpu_1_tx_4.external_connection
add_interface cpu_1_tx_5_external_connection conduit end
set_interface_property cpu_1_tx_5_external_connection EXPORT_OF cpu_1_tx_5.external_connection
add_interface cpu_1_tx_6_external_connection conduit end
set_interface_property cpu_1_tx_6_external_connection EXPORT_OF cpu_1_tx_6.external_connection
add_interface cpu_1_tx_7_external_connection conduit end
set_interface_property cpu_1_tx_7_external_connection EXPORT_OF cpu_1_tx_7.external_connection
add_interface leds conduit end
set_interface_property leds EXPORT_OF leds.external_connection
add_interface memory conduit end
set_interface_property memory EXPORT_OF DDR2_Controller.memory
add_interface memory_0 conduit end
set_interface_property memory_0 EXPORT_OF DDR2_Controller_0.memory
add_interface oct conduit end
set_interface_property oct EXPORT_OF DDR2_Controller.oct
add_interface oct_0 conduit end
set_interface_property oct_0 EXPORT_OF DDR2_Controller_0.oct
add_interface pll_clock clock source
set_interface_property pll_clock EXPORT_OF altpll_0.c0
add_interface sd_card conduit end
set_interface_property sd_card EXPORT_OF Altera_UP_SD_Card_Avalon_Interface_0.conduit_end
add_interface switches conduit end
set_interface_property switches EXPORT_OF switches.external_connection
add_interface vga_clock clock source
set_interface_property vga_clock EXPORT_OF altpll_1.c0

set_interconnect_requirement {$system} qsys_mm.clockCrossingAdapter HANDSHAKE
set_interconnect_requirement {$system} qsys_mm.enableEccProtection FALSE
set_interconnect_requirement {$system} qsys_mm.insertDefaultSlave FALSE
set_interconnect_requirement {$system} qsys_mm.maxAdditionalLatency 1

save_system nios_system.qsys
